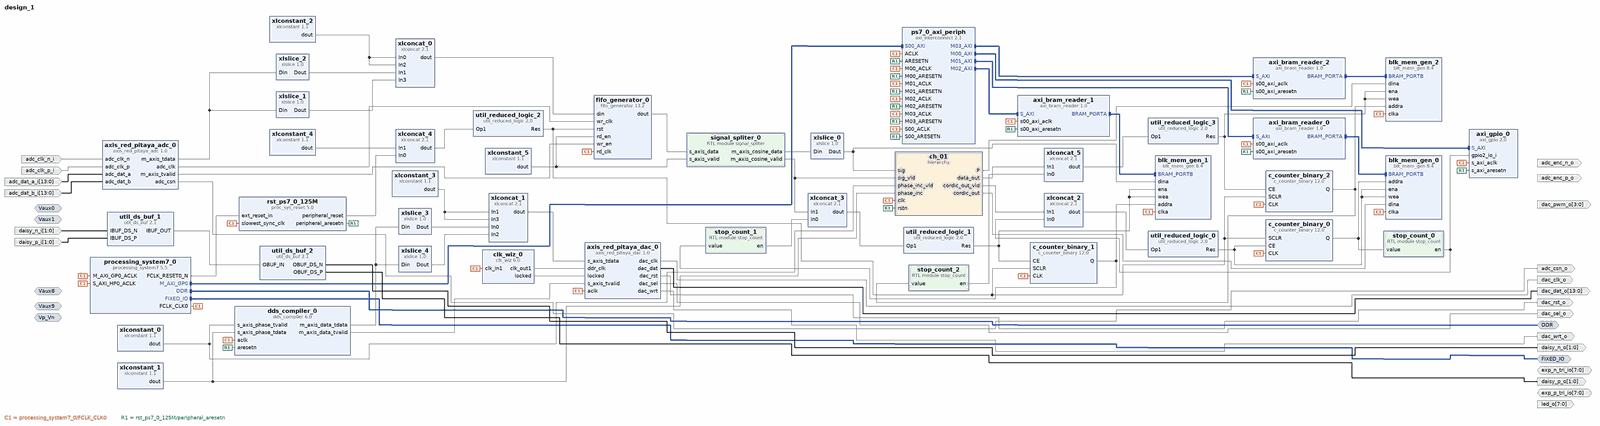
[diagram p0: block diagram of the top level, whole]
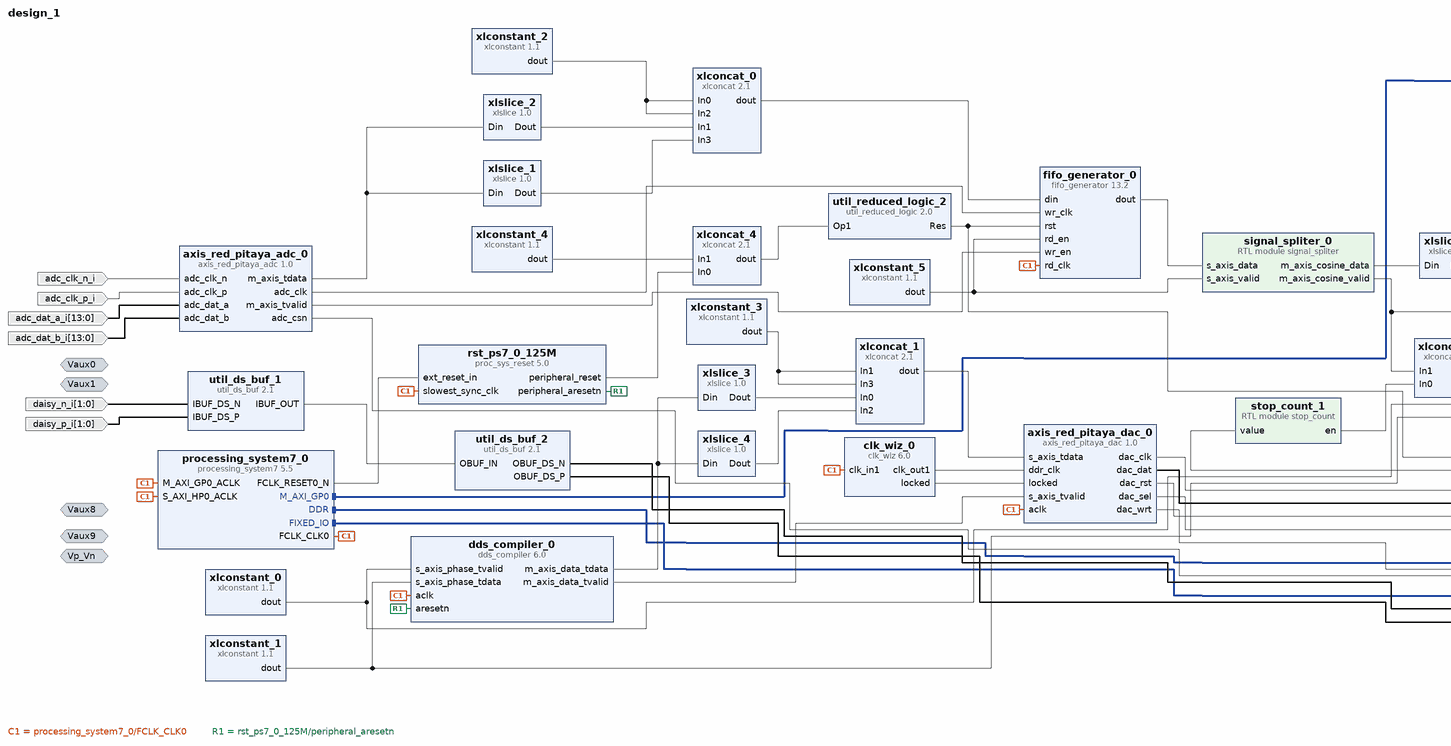
[diagram p1: block diagram of the top level, left part]
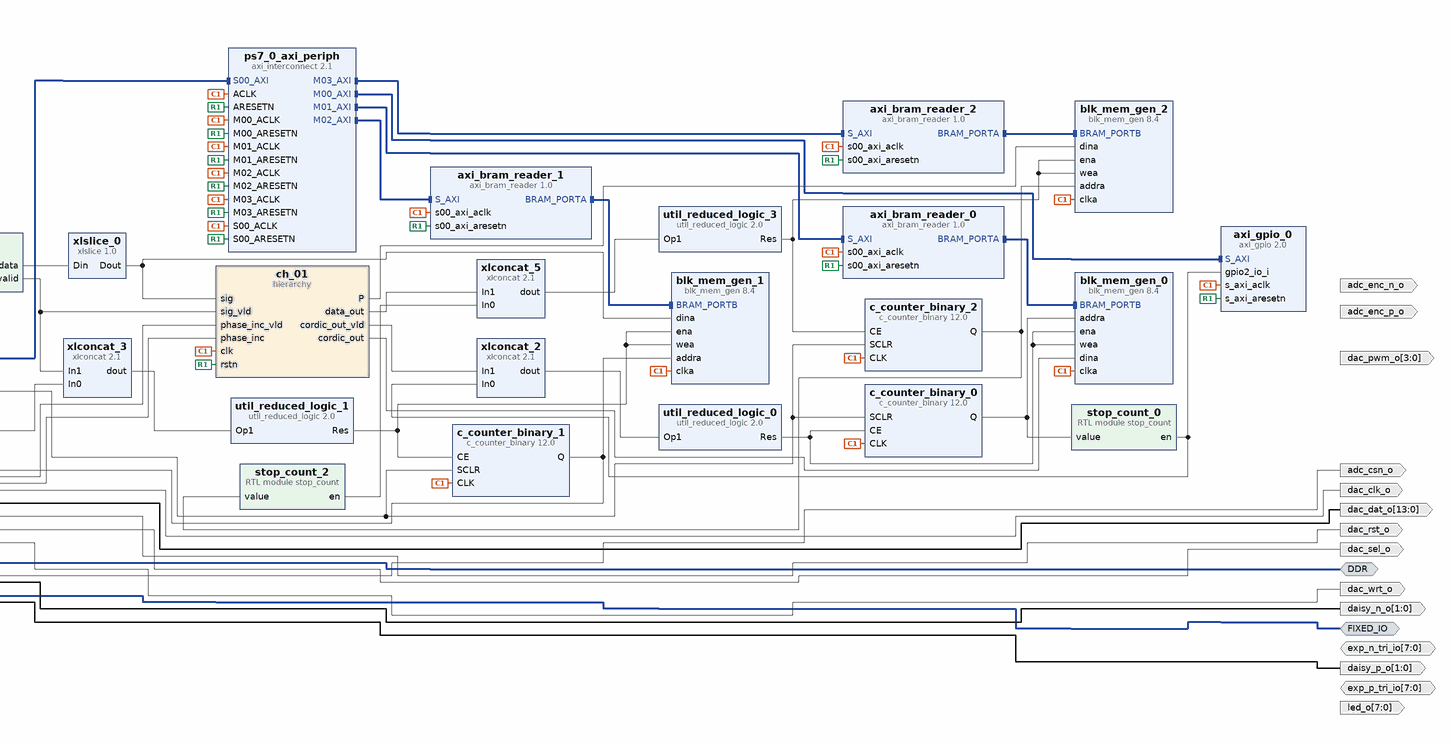
[diagram p2: block diagram of the top level, right part]
# Vivado block design design_1, xc7z010clg400-1, Vivado 2020.1
create_bd_design design_1

create_bd_intf_port -mode Master -vlnv xilinx.com:interface:ddrx_rtl:1.0 DDR
create_bd_intf_port -mode Master -vlnv xilinx.com:display_processing_system7:fixedio_rtl:1.0 FIXED_IO
create_bd_intf_port -mode Slave -vlnv xilinx.com:interface:diff_analog_io_rtl:1.0 Vaux0
create_bd_intf_port -mode Slave -vlnv xilinx.com:interface:diff_analog_io_rtl:1.0 Vaux1
create_bd_intf_port -mode Slave -vlnv xilinx.com:interface:diff_analog_io_rtl:1.0 Vaux8
create_bd_intf_port -mode Slave -vlnv xilinx.com:interface:diff_analog_io_rtl:1.0 Vaux9
create_bd_intf_port -mode Slave -vlnv xilinx.com:interface:diff_analog_io_rtl:1.0 Vp_Vn
create_bd_port -dir I adc_clk_n_i
create_bd_port -dir I adc_clk_p_i
create_bd_port -dir O adc_csn_o
create_bd_port -dir I -from 13 -to 0 adc_dat_a_i
create_bd_port -dir I -from 13 -to 0 adc_dat_b_i
create_bd_port -dir O adc_enc_n_o
create_bd_port -dir O adc_enc_p_o
create_bd_port -dir O dac_clk_o
create_bd_port -dir O -from 13 -to 0 dac_dat_o
create_bd_port -dir O -from 3 -to 0 dac_pwm_o
create_bd_port -dir O dac_rst_o
create_bd_port -dir O dac_sel_o
create_bd_port -dir O dac_wrt_o
create_bd_port -dir I -from 1 -to 0 daisy_n_i
create_bd_port -dir O -from 1 -to 0 daisy_n_o
create_bd_port -dir I -from 1 -to 0 daisy_p_i
create_bd_port -dir O -from 1 -to 0 daisy_p_o
create_bd_port -dir IO -from 7 -to 0 exp_n_tri_io
create_bd_port -dir IO -from 7 -to 0 exp_p_tri_io
create_bd_port -dir O -from 7 -to 0 led_o

create_bd_cell -type ip -vlnv xilinx.com:ip:axi_gpio:2.0 axi_gpio_0
set_property -dict [list \
  CONFIG.C_ALL_INPUTS_2 1 \
  CONFIG.C_ALL_OUTPUTS 1 \
  CONFIG.C_DOUT_DEFAULT 0x00000001 \
  CONFIG.C_GPIO2_WIDTH 1 \
  CONFIG.C_GPIO_WIDTH 1 \
  CONFIG.C_IS_DUAL 1 \
] [get_bd_cells axi_gpio_0]
create_bd_cell -type ip -vlnv pavel-demin:user:axis_red_pitaya_adc:1.0 axis_red_pitaya_adc_0
create_bd_cell -type ip -vlnv pavel-demin:user:axis_red_pitaya_dac:1.0 axis_red_pitaya_dac_0
create_bd_cell -type ip -vlnv xilinx.com:ip:dds_compiler:6.0 dds_compiler_0
set_property -dict [list \
  CONFIG.Amplitude_Mode Full_Range \
  CONFIG.DATA_Has_TLAST Not_Required \
  CONFIG.DDS_Clock_Rate 125 \
  CONFIG.Frequency_Resolution 0.4 \
  CONFIG.Has_ACLKEN false \
  CONFIG.Has_ARESETn true \
  CONFIG.Has_Phase_Out false \
  CONFIG.Latency 7 \
  CONFIG.M_DATA_Has_TUSER Not_Required \
  CONFIG.Noise_Shaping None \
  CONFIG.Output_Frequency1 0 \
  CONFIG.Output_Width 16 \
  CONFIG.PINC1 0 \
  CONFIG.Parameter_Entry Hardware_Parameters \
  CONFIG.PartsPresent Phase_Generator_and_SIN_COS_LUT \
  CONFIG.Phase_Increment Streaming \
  CONFIG.Phase_Width 16 \
  CONFIG.S_PHASE_Has_TUSER Not_Required \
  CONFIG.Spurious_Free_Dynamic_Range 45 \
] [get_bd_cells dds_compiler_0]
create_bd_cell -type ip -vlnv xilinx.com:ip:processing_system7:5.5 processing_system7_0
set_property -dict [list \
  CONFIG.PCW_APU_PERIPHERAL_FREQMHZ 666.666666 \
  CONFIG.PCW_ENET0_ENET0_IO {MIO 16 .. 27} \
  CONFIG.PCW_ENET0_GRP_MDIO_ENABLE 1 \
  CONFIG.PCW_ENET0_GRP_MDIO_IO EMIO \
  CONFIG.PCW_ENET0_PERIPHERAL_ENABLE 1 \
  CONFIG.PCW_ENET0_RESET_ENABLE 0 \
  CONFIG.PCW_ENET_RESET_ENABLE 1 \
  CONFIG.PCW_ENET_RESET_SELECT {Share reset pin} \
  CONFIG.PCW_FPGA0_PERIPHERAL_FREQMHZ 125 \
  CONFIG.PCW_FPGA1_PERIPHERAL_FREQMHZ 250 \
  CONFIG.PCW_FPGA3_PERIPHERAL_FREQMHZ 200 \
  CONFIG.PCW_GPIO_MIO_GPIO_ENABLE 1 \
  CONFIG.PCW_GPIO_MIO_GPIO_IO MIO \
  CONFIG.PCW_GPIO_PERIPHERAL_ENABLE 1 \
  CONFIG.PCW_I2C0_GRP_INT_ENABLE 0 \
  CONFIG.PCW_I2C0_I2C0_IO {MIO 50 .. 51} \
  CONFIG.PCW_I2C0_PERIPHERAL_ENABLE 1 \
  CONFIG.PCW_I2C_PERIPHERAL_FREQMHZ 111.111115 \
  CONFIG.PCW_I2C_RESET_ENABLE 1 \
  CONFIG.PCW_I2C_RESET_SELECT {Share reset pin} \
  CONFIG.PCW_IMPORT_BOARD_PRESET cfg/red_pitaya.xml \
  CONFIG.PCW_PERIPHERAL_BOARD_PRESET None \
  CONFIG.PCW_PRESET_BANK1_VOLTAGE {LVCMOS 2.5V} \
  CONFIG.PCW_QSPI_GRP_SINGLE_SS_ENABLE 1 \
  CONFIG.PCW_QSPI_GRP_SINGLE_SS_IO {MIO 1 .. 6} \
  CONFIG.PCW_QSPI_PERIPHERAL_ENABLE 1 \
  CONFIG.PCW_QSPI_PERIPHERAL_FREQMHZ 125 \
  CONFIG.PCW_QSPI_QSPI_IO {MIO 1 .. 6} \
  CONFIG.PCW_SD0_GRP_CD_ENABLE 1 \
  CONFIG.PCW_SD0_GRP_CD_IO {MIO 46} \
  CONFIG.PCW_SD0_GRP_WP_ENABLE 1 \
  CONFIG.PCW_SD0_GRP_WP_IO {MIO 47} \
  CONFIG.PCW_SD0_PERIPHERAL_ENABLE 1 \
  CONFIG.PCW_SD0_SD0_IO {MIO 40 .. 45} \
  CONFIG.PCW_SDIO_PERIPHERAL_FREQMHZ 100 \
  CONFIG.PCW_SINGLE_QSPI_DATA_MODE x4 \
  CONFIG.PCW_SPI0_PERIPHERAL_ENABLE 1 \
  CONFIG.PCW_SPI0_SPI0_IO EMIO \
  CONFIG.PCW_SPI1_PERIPHERAL_ENABLE 1 \
  CONFIG.PCW_SPI1_SPI1_IO {MIO 10 .. 15} \
  CONFIG.PCW_TTC0_PERIPHERAL_ENABLE 1 \
  CONFIG.PCW_TTC0_TTC0_IO EMIO \
  CONFIG.PCW_UART0_PERIPHERAL_ENABLE 1 \
  CONFIG.PCW_UART0_UART0_IO {MIO 14 .. 15} \
  CONFIG.PCW_UART1_PERIPHERAL_ENABLE 1 \
  CONFIG.PCW_UART1_UART1_IO {MIO 8 .. 9} \
  CONFIG.PCW_UART_PERIPHERAL_FREQMHZ 100 \
  CONFIG.PCW_UIPARAM_DDR_BUS_WIDTH {16 Bit} \
  CONFIG.PCW_UIPARAM_DDR_FREQ_MHZ 533.333333 \
  CONFIG.PCW_UIPARAM_DDR_PARTNO {MT41J256M16 RE-125} \
  CONFIG.PCW_USB0_PERIPHERAL_ENABLE 1 \
  CONFIG.PCW_USB0_RESET_ENABLE 1 \
  CONFIG.PCW_USB0_RESET_IO {MIO 48} \
  CONFIG.PCW_USB0_USB0_IO {MIO 28 .. 39} \
  CONFIG.PCW_USB_RESET_ENABLE 1 \
  CONFIG.PCW_USB_RESET_SELECT {Share reset pin} \
  CONFIG.PCW_USE_S_AXI_HP0 1 \
] [get_bd_cells processing_system7_0]
# 509 more settings of processing_system7_0 are not shown: defaults, MIO pin electricals, DDR timing, and values the tool derives
create_bd_cell -type ip -vlnv xilinx.com:ip:axi_interconnect:2.1 ps7_0_axi_periph
set_property -dict {CONFIG.NUM_MI 4} [get_bd_cells ps7_0_axi_periph]
create_bd_cell -type ip -vlnv xilinx.com:ip:proc_sys_reset:5.0 rst_ps7_0_125M
create_bd_cell -type module -reference signal_spliter signal_spliter_0
create_bd_cell -type ip -vlnv xilinx.com:ip:util_ds_buf:2.1 util_ds_buf_1
set_property -dict {CONFIG.C_SIZE 2} [get_bd_cells util_ds_buf_1]
create_bd_cell -type ip -vlnv xilinx.com:ip:util_ds_buf:2.1 util_ds_buf_2
set_property -dict {CONFIG.C_BUF_TYPE OBUFDS CONFIG.C_SIZE 2} [get_bd_cells util_ds_buf_2]
create_bd_cell -type ip -vlnv xilinx.com:ip:xlconcat:2.1 xlconcat_0
set_property -dict [list \
  CONFIG.IN0_WIDTH 2 \
  CONFIG.IN1_WIDTH 14 \
  CONFIG.IN2_WIDTH 2 \
  CONFIG.IN3_WIDTH 14 \
  CONFIG.NUM_PORTS 4 \
] [get_bd_cells xlconcat_0]
create_bd_cell -type ip -vlnv xilinx.com:ip:xlconcat:2.1 xlconcat_1
set_property -dict [list \
  CONFIG.IN0_WIDTH 14 \
  CONFIG.IN1_WIDTH 2 \
  CONFIG.IN2_WIDTH 14 \
  CONFIG.IN3_WIDTH 2 \
  CONFIG.NUM_PORTS 4 \
] [get_bd_cells xlconcat_1]
create_bd_cell -type ip -vlnv xilinx.com:ip:xlconstant:1.1 xlconstant_0
create_bd_cell -type ip -vlnv xilinx.com:ip:xlconstant:1.1 xlconstant_1
set_property -dict {CONFIG.CONST_VAL 524 CONFIG.CONST_WIDTH 16} [get_bd_cells xlconstant_1]
create_bd_cell -type ip -vlnv xilinx.com:ip:xlconstant:1.1 xlconstant_2
set_property -dict {CONFIG.CONST_VAL 0 CONFIG.CONST_WIDTH 2} [get_bd_cells xlconstant_2]
create_bd_cell -type ip -vlnv xilinx.com:ip:xlconstant:1.1 xlconstant_3
set_property -dict {CONFIG.CONST_VAL 0 CONFIG.CONST_WIDTH 2} [get_bd_cells xlconstant_3]
create_bd_cell -type ip -vlnv xilinx.com:ip:xlconstant:1.1 xlconstant_4
set_property -dict {CONFIG.CONST_VAL 0} [get_bd_cells xlconstant_4]
create_bd_cell -type ip -vlnv xilinx.com:ip:xlslice:1.0 xlslice_1
set_property -dict {CONFIG.DIN_FROM 29 CONFIG.DIN_TO 16 CONFIG.DOUT_WIDTH 14} [get_bd_cells xlslice_1]
create_bd_cell -type ip -vlnv xilinx.com:ip:xlslice:1.0 xlslice_2
set_property -dict {CONFIG.DIN_FROM 13 CONFIG.DIN_TO 0 CONFIG.DOUT_WIDTH 14} [get_bd_cells xlslice_2]
create_bd_cell -type ip -vlnv xilinx.com:ip:xlslice:1.0 xlslice_3
set_property -dict {CONFIG.DIN_FROM 15 CONFIG.DIN_TO 2 CONFIG.DOUT_WIDTH 14} [get_bd_cells xlslice_3]
create_bd_cell -type ip -vlnv xilinx.com:ip:xlslice:1.0 xlslice_4
set_property -dict {CONFIG.DIN_FROM 31 CONFIG.DIN_TO 18 CONFIG.DOUT_WIDTH 14} [get_bd_cells xlslice_4]
create_bd_cell -type ip -vlnv xilinx.com:ip:xlslice:1.0 xlslice_0
set_property -dict {CONFIG.DIN_FROM 15 CONFIG.DOUT_WIDTH 16} [get_bd_cells xlslice_0]
create_bd_cell -type ip -vlnv xilinx.com:ip:clk_wiz:6.0 clk_wiz_0
set_property -dict [list \
  CONFIG.CLKIN1_JITTER_PS 80.0 \
  CONFIG.CLKOUT1_JITTER 104.759 \
  CONFIG.CLKOUT1_PHASE_ERROR 96.948 \
  CONFIG.CLKOUT1_REQUESTED_OUT_FREQ 250 \
  CONFIG.MMCM_CLKFBOUT_MULT_F 8.000 \
  CONFIG.MMCM_CLKIN1_PERIOD 8.000 \
  CONFIG.MMCM_CLKOUT0_DIVIDE_F 4.000 \
  CONFIG.PRIM_IN_FREQ 125 \
  CONFIG.USE_RESET false \
] [get_bd_cells clk_wiz_0]
create_bd_cell -type ip -vlnv xilinx.com:ip:blk_mem_gen:8.4 blk_mem_gen_0
set_property -dict [list \
  CONFIG.Additional_Inputs_for_Power_Estimation false \
  CONFIG.Assume_Synchronous_Clk true \
  CONFIG.Enable_32bit_Address false \
  CONFIG.Enable_B Use_ENB_Pin \
  CONFIG.Memory_Type Simple_Dual_Port_RAM \
  CONFIG.Operating_Mode_A NO_CHANGE \
  CONFIG.Port_A_Clock 100 \
  CONFIG.Port_B_Clock 100 \
  CONFIG.Port_B_Enable_Rate 100 \
  CONFIG.Read_Width_B 32 \
  CONFIG.Register_PortB_Output_of_Memory_Primitives true \
  CONFIG.Use_Byte_Write_Enable false \
  CONFIG.Write_Depth_A 1024 \
  CONFIG.Write_Width_A 32 \
  CONFIG.Write_Width_B 32 \
  CONFIG.use_bram_block Stand_Alone \
] [get_bd_cells blk_mem_gen_0]
create_bd_cell -type ip -vlnv xilinx.com:ip:c_counter_binary:12.0 c_counter_binary_0
set_property -dict [list \
  CONFIG.CE true \
  CONFIG.Final_Count_Value 400 \
  CONFIG.Load false \
  CONFIG.Output_Width 11 \
  CONFIG.Restrict_Count true \
  CONFIG.SCLR true \
] [get_bd_cells c_counter_binary_0]
create_bd_cell -type ip -vlnv anton-potocnik:user:axi_bram_reader:1.0 axi_bram_reader_0
create_bd_cell -type ip -vlnv xilinx.com:ip:blk_mem_gen:8.4 blk_mem_gen_1
set_property -dict [list \
  CONFIG.Enable_32bit_Address false \
  CONFIG.Enable_B Use_ENB_Pin \
  CONFIG.Memory_Type Simple_Dual_Port_RAM \
  CONFIG.Operating_Mode_A NO_CHANGE \
  CONFIG.Port_B_Clock 100 \
  CONFIG.Port_B_Enable_Rate 100 \
  CONFIG.Read_Width_B 32 \
  CONFIG.Register_PortB_Output_of_Memory_Primitives true \
  CONFIG.Use_Byte_Write_Enable false \
  CONFIG.Write_Depth_A 1024 \
  CONFIG.Write_Width_A 32 \
  CONFIG.Write_Width_B 32 \
  CONFIG.use_bram_block Stand_Alone \
] [get_bd_cells blk_mem_gen_1]
create_bd_cell -type ip -vlnv anton-potocnik:user:axi_bram_reader:1.0 axi_bram_reader_1
create_bd_cell -type ip -vlnv xilinx.com:ip:c_counter_binary:12.0 c_counter_binary_1
set_property -dict [list \
  CONFIG.CE true \
  CONFIG.Final_Count_Value 400 \
  CONFIG.Load false \
  CONFIG.Output_Width 11 \
  CONFIG.Restrict_Count true \
  CONFIG.SCLR true \
] [get_bd_cells c_counter_binary_1]
create_bd_cell -type module -reference stop_count stop_count_0
create_bd_cell -type module -reference stop_count stop_count_1
create_bd_cell -type ip -vlnv xilinx.com:ip:util_reduced_logic:2.0 util_reduced_logic_0
set_property -dict {CONFIG.C_SIZE 2} [get_bd_cells util_reduced_logic_0]
create_bd_cell -type ip -vlnv xilinx.com:ip:xlconcat:2.1 xlconcat_2
create_bd_cell -type ip -vlnv xilinx.com:ip:util_reduced_logic:2.0 util_reduced_logic_1
set_property -dict {CONFIG.C_SIZE 2} [get_bd_cells util_reduced_logic_1]
create_bd_cell -type ip -vlnv xilinx.com:ip:xlconcat:2.1 xlconcat_3
create_bd_cell -type hier ch_01
create_bd_cell -type ip -vlnv xilinx.com:ip:fifo_generator:13.2 fifo_generator_0
set_property -dict [list \
  CONFIG.Enable_Reset_Synchronization true \
  CONFIG.Enable_Safety_Circuit true \
  CONFIG.FIFO_Implementation_rach Common_Clock_Distributed_RAM \
  CONFIG.FIFO_Implementation_wach Common_Clock_Distributed_RAM \
  CONFIG.FIFO_Implementation_wrch Common_Clock_Distributed_RAM \
  CONFIG.Fifo_Implementation Independent_Clocks_Block_RAM \
  CONFIG.Full_Flags_Reset_Value 1 \
  CONFIG.INTERFACE_TYPE Native \
  CONFIG.Input_Data_Width 32 \
  CONFIG.Input_Depth 16 \
  CONFIG.Output_Data_Width 32 \
  CONFIG.Read_Data_Count true \
  CONFIG.Read_Data_Count_Width 4 \
  CONFIG.Reset_Pin true \
  CONFIG.Use_Dout_Reset true \
  CONFIG.Use_Embedded_Registers false \
  CONFIG.Write_Acknowledge_Flag false \
  CONFIG.Write_Data_Count true \
  CONFIG.Write_Data_Count_Width 4 \
] [get_bd_cells fifo_generator_0]
create_bd_cell -type ip -vlnv xilinx.com:ip:xlconstant:1.1 xlconstant_5
create_bd_cell -type ip -vlnv xilinx.com:ip:util_reduced_logic:2.0 util_reduced_logic_2
set_property -dict {CONFIG.C_OPERATION or CONFIG.C_SIZE 2} [get_bd_cells util_reduced_logic_2]
create_bd_cell -type ip -vlnv xilinx.com:ip:xlconcat:2.1 xlconcat_4
create_bd_cell -type ip -vlnv xilinx.com:ip:blk_mem_gen:8.4 blk_mem_gen_2
set_property -dict [list \
  CONFIG.Enable_32bit_Address false \
  CONFIG.Enable_B Use_ENB_Pin \
  CONFIG.Memory_Type Simple_Dual_Port_RAM \
  CONFIG.Operating_Mode_A NO_CHANGE \
  CONFIG.Port_B_Clock 100 \
  CONFIG.Port_B_Enable_Rate 100 \
  CONFIG.Read_Width_B 32 \
  CONFIG.Register_PortB_Output_of_Memory_Primitives true \
  CONFIG.Use_Byte_Write_Enable false \
  CONFIG.Write_Depth_A 1024 \
  CONFIG.Write_Width_A 32 \
  CONFIG.Write_Width_B 32 \
  CONFIG.use_bram_block Stand_Alone \
] [get_bd_cells blk_mem_gen_2]
create_bd_cell -type ip -vlnv anton-potocnik:user:axi_bram_reader:1.0 axi_bram_reader_2
create_bd_cell -type ip -vlnv xilinx.com:ip:c_counter_binary:12.0 c_counter_binary_2
set_property -dict [list \
  CONFIG.CE true \
  CONFIG.Final_Count_Value 400 \
  CONFIG.Load false \
  CONFIG.Output_Width 11 \
  CONFIG.Restrict_Count true \
  CONFIG.SCLR true \
] [get_bd_cells c_counter_binary_2]
create_bd_cell -type ip -vlnv xilinx.com:ip:util_reduced_logic:2.0 util_reduced_logic_3
set_property -dict {CONFIG.C_SIZE 2} [get_bd_cells util_reduced_logic_3]
create_bd_cell -type ip -vlnv xilinx.com:ip:xlconcat:2.1 xlconcat_5
create_bd_cell -type module -reference stop_count stop_count_2

# ---- hierarchy /ch_01 ----
current_bd_instance /ch_01
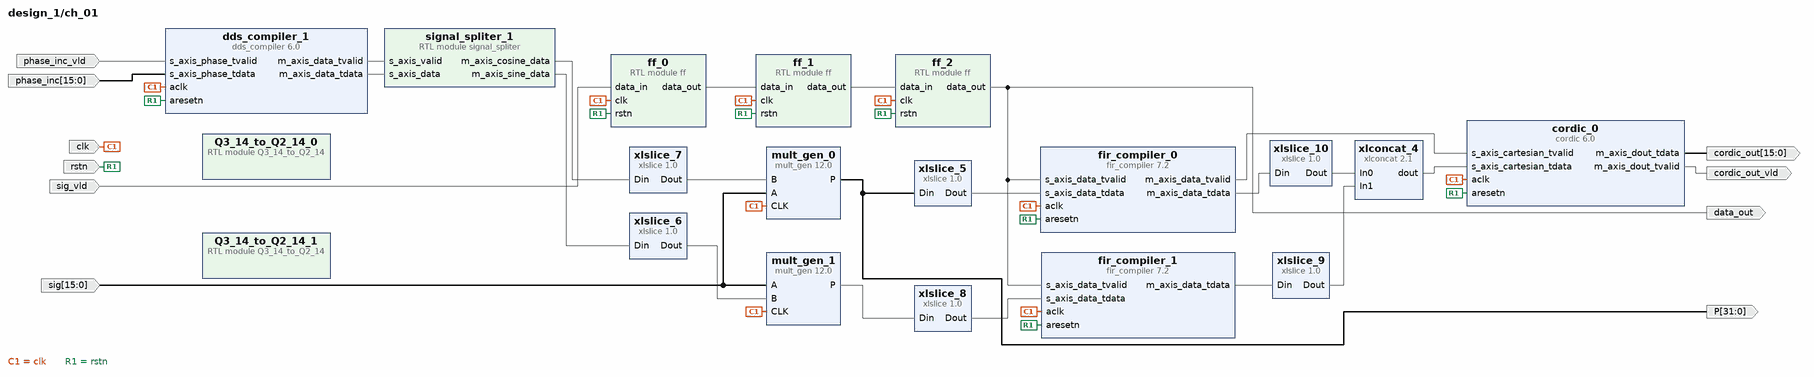
[diagram p3: block diagram inside /ch_01]
create_bd_pin -dir I -type clk clk
create_bd_pin -dir I -type rst rstn
create_bd_pin -dir O cordic_out_vld
create_bd_pin -dir O -from 15 -to 0 cordic_out
create_bd_pin -dir I phase_inc_vld
create_bd_pin -dir I -from 15 -to 0 phase_inc
create_bd_pin -dir I sig_vld
create_bd_pin -dir I -from 15 -to 0 sig
create_bd_pin -dir O -from 31 -to 0 -type data P
create_bd_pin -dir O data_out

create_bd_cell -type module -reference Q3_14_to_Q2_14 Q3_14_to_Q2_14_0
create_bd_cell -type module -reference Q3_14_to_Q2_14 Q3_14_to_Q2_14_1
create_bd_cell -type ip -vlnv xilinx.com:ip:cordic:6.0 cordic_0
set_property -dict [list \
  CONFIG.ARESETN true \
  CONFIG.Data_Format SignedFraction \
  CONFIG.Functional_Selection Arc_Tan \
  CONFIG.Input_Width 16 \
] [get_bd_cells cordic_0]
create_bd_cell -type ip -vlnv xilinx.com:ip:dds_compiler:6.0 dds_compiler_1
set_property -dict [list \
  CONFIG.Amplitude_Mode Full_Range \
  CONFIG.DATA_Has_TLAST Not_Required \
  CONFIG.DDS_Clock_Rate 125 \
  CONFIG.Frequency_Resolution 0.4 \
  CONFIG.Has_ACLKEN false \
  CONFIG.Has_ARESETn true \
  CONFIG.Has_Phase_Out false \
  CONFIG.Latency 7 \
  CONFIG.M_DATA_Has_TUSER Not_Required \
  CONFIG.Noise_Shaping None \
  CONFIG.Output_Frequency1 0 \
  CONFIG.Output_Width 16 \
  CONFIG.PINC1 0 \
  CONFIG.Parameter_Entry Hardware_Parameters \
  CONFIG.PartsPresent Phase_Generator_and_SIN_COS_LUT \
  CONFIG.Phase_Increment Streaming \
  CONFIG.Phase_Width 16 \
  CONFIG.S_PHASE_Has_TUSER Not_Required \
  CONFIG.Spurious_Free_Dynamic_Range 45 \
] [get_bd_cells dds_compiler_1]
create_bd_cell -type module -reference ff ff_0
create_bd_cell -type module -reference ff ff_1
create_bd_cell -type module -reference ff ff_2
create_bd_cell -type ip -vlnv xilinx.com:ip:fir_compiler:7.2 fir_compiler_0
set_property -dict [list \
  CONFIG.Channel_Sequence Basic \
  CONFIG.Clock_Frequency 125 \
  CONFIG.CoefficientVector {0.128241, 0.009100, 0.009381, 0.009710, 0.009974, 0.010281, 0.010538, 0.010826, 0.011053, 0.011332, 0.011563, 0.011688, 0.012018, 0.012223, 0.012348, 0.012513, 0.012636, 0.012782, 0.012896, 0.013029, 0.013097, 0.013190, 0.013254, 0.013289, 0.013299, 0.013335, 0.013299, 0.013289, 0.013254, 0.013190, 0.013097, 0.013029, 0.012896, 0.012782, 0.012636, 0.012513, 0.012348, 0.012223, 0.012018, 0.011688, 0.011563, 0.011332, 0.011053, 0.010826, 0.010538, 0.010281, 0.009974, 0.009710, 0.009381, 0.009100, 0.128241} \
  CONFIG.Coefficient_Fractional_Bits 18 \
  CONFIG.Coefficient_Sets 1 \
  CONFIG.Coefficient_Sign Unsigned \
  CONFIG.Coefficient_Structure Inferred \
  CONFIG.Coefficient_Width 16 \
  CONFIG.ColumnConfig 13 \
  CONFIG.DATA_Has_TLAST Not_Required \
  CONFIG.Data_Fractional_Bits 14 \
  CONFIG.Data_Sign Signed \
  CONFIG.Data_Width 16 \
  CONFIG.Decimation_Rate 2 \
  CONFIG.Filter_Architecture Systolic_Multiply_Accumulate \
  CONFIG.Filter_Type Decimation \
  CONFIG.Has_ARESETn true \
  CONFIG.Interpolation_Rate 1 \
  CONFIG.M_DATA_Has_TUSER Not_Required \
  CONFIG.Number_Channels 1 \
  CONFIG.Output_Rounding_Mode Full_Precision \
  CONFIG.Output_Width 34 \
  CONFIG.Quantization Quantize_Only \
  CONFIG.RateSpecification Frequency_Specification \
  CONFIG.S_DATA_Has_TUSER Not_Required \
  CONFIG.Sample_Frequency 125 \
  CONFIG.Select_Pattern All \
  CONFIG.Zero_Pack_Factor 1 \
] [get_bd_cells fir_compiler_0]
create_bd_cell -type ip -vlnv xilinx.com:ip:fir_compiler:7.2 fir_compiler_1
set_property -dict [list \
  CONFIG.Channel_Sequence Basic \
  CONFIG.Clock_Frequency 125 \
  CONFIG.CoefficientVector {0.128241, 0.009100, 0.009381, 0.009710, 0.009974, 0.010281, 0.010538, 0.010826, 0.011053, 0.011332, 0.011563, 0.011688, 0.012018, 0.012223, 0.012348, 0.012513, 0.012636, 0.012782, 0.012896, 0.013029, 0.013097, 0.013190, 0.013254, 0.013289, 0.013299, 0.013335, 0.013299, 0.013289, 0.013254, 0.013190, 0.013097, 0.013029, 0.012896, 0.012782, 0.012636, 0.012513, 0.012348, 0.012223, 0.012018, 0.011688, 0.011563, 0.011332, 0.011053, 0.010826, 0.010538, 0.010281, 0.009974, 0.009710, 0.009381, 0.009100, 0.128241} \
  CONFIG.Coefficient_Fractional_Bits 18 \
  CONFIG.Coefficient_Sets 1 \
  CONFIG.Coefficient_Sign Unsigned \
  CONFIG.Coefficient_Structure Inferred \
  CONFIG.Coefficient_Width 16 \
  CONFIG.ColumnConfig 13 \
  CONFIG.DATA_Has_TLAST Not_Required \
  CONFIG.Data_Fractional_Bits 14 \
  CONFIG.Data_Sign Signed \
  CONFIG.Data_Width 16 \
  CONFIG.Decimation_Rate 2 \
  CONFIG.Filter_Architecture Systolic_Multiply_Accumulate \
  CONFIG.Filter_Type Decimation \
  CONFIG.Has_ARESETn true \
  CONFIG.Interpolation_Rate 1 \
  CONFIG.M_DATA_Has_TUSER Not_Required \
  CONFIG.Number_Channels 1 \
  CONFIG.Output_Rounding_Mode Full_Precision \
  CONFIG.Output_Width 34 \
  CONFIG.Quantization Quantize_Only \
  CONFIG.RateSpecification Frequency_Specification \
  CONFIG.S_DATA_Has_TUSER Not_Required \
  CONFIG.Sample_Frequency 125 \
  CONFIG.Select_Pattern All \
  CONFIG.Zero_Pack_Factor 1 \
] [get_bd_cells fir_compiler_1]
create_bd_cell -type ip -vlnv xilinx.com:ip:mult_gen:12.0 mult_gen_0
set_property -dict [list \
  CONFIG.Multiplier_Construction Use_Mults \
  CONFIG.OutputWidthHigh 31 \
  CONFIG.PipeStages 3 \
  CONFIG.PortAType Signed \
  CONFIG.PortAWidth 16 \
  CONFIG.PortBType Signed \
  CONFIG.PortBWidth 16 \
  CONFIG.Use_Custom_Output_Width true \
] [get_bd_cells mult_gen_0]
create_bd_cell -type ip -vlnv xilinx.com:ip:mult_gen:12.0 mult_gen_1
set_property -dict [list \
  CONFIG.Multiplier_Construction Use_Mults \
  CONFIG.OutputWidthHigh 31 \
  CONFIG.PipeStages 3 \
  CONFIG.PortAType Signed \
  CONFIG.PortAWidth 16 \
  CONFIG.PortBType Signed \
  CONFIG.PortBWidth 16 \
  CONFIG.Use_Custom_Output_Width true \
] [get_bd_cells mult_gen_1]
create_bd_cell -type module -reference signal_spliter signal_spliter_1
create_bd_cell -type ip -vlnv xilinx.com:ip:xlconcat:2.1 xlconcat_4
set_property -dict {CONFIG.IN0_WIDTH 16 CONFIG.IN1_WIDTH 16} [get_bd_cells xlconcat_4]
create_bd_cell -type ip -vlnv xilinx.com:ip:xlslice:1.0 xlslice_5
set_property -dict {CONFIG.DIN_FROM 31 CONFIG.DIN_TO 16 CONFIG.DIN_WIDTH 32 CONFIG.DOUT_WIDTH 16} [get_bd_cells xlslice_5]
create_bd_cell -type ip -vlnv xilinx.com:ip:xlslice:1.0 xlslice_6
set_property -dict {CONFIG.DIN_FROM 15 CONFIG.DOUT_WIDTH 16} [get_bd_cells xlslice_6]
create_bd_cell -type ip -vlnv xilinx.com:ip:xlslice:1.0 xlslice_7
set_property -dict {CONFIG.DIN_FROM 15 CONFIG.DOUT_WIDTH 16} [get_bd_cells xlslice_7]
create_bd_cell -type ip -vlnv xilinx.com:ip:xlslice:1.0 xlslice_8
set_property -dict {CONFIG.DIN_FROM 31 CONFIG.DIN_TO 16 CONFIG.DIN_WIDTH 32 CONFIG.DOUT_WIDTH 16} [get_bd_cells xlslice_8]
create_bd_cell -type ip -vlnv xilinx.com:ip:xlslice:1.0 xlslice_9
set_property -dict {CONFIG.DIN_FROM 33 CONFIG.DIN_TO 18 CONFIG.DIN_WIDTH 40 CONFIG.DOUT_WIDTH 16} [get_bd_cells xlslice_9]
create_bd_cell -type ip -vlnv xilinx.com:ip:xlslice:1.0 xlslice_10
set_property -dict {CONFIG.DIN_FROM 33 CONFIG.DIN_TO 18 CONFIG.DIN_WIDTH 40 CONFIG.DOUT_WIDTH 16} [get_bd_cells xlslice_10]

# ---- connections ----

current_bd_instance /ch_01
connect_bd_net [get_bd_pins fir_compiler_0/m_axis_data_tvalid] [get_bd_pins cordic_0/s_axis_cartesian_tvalid]
connect_bd_net -net xlconcat_2_dout1 [get_bd_pins xlconcat_4/dout] [get_bd_pins cordic_0/s_axis_cartesian_tdata]
connect_bd_net -net dds_compiler_0_m_axis_data_tvalid1 [get_bd_pins dds_compiler_1/m_axis_data_tvalid] [get_bd_pins signal_spliter_1/s_axis_valid]
connect_bd_net -net dds_compiler_0_m_axis_data_tdata1 [get_bd_pins dds_compiler_1/m_axis_data_tdata] [get_bd_pins signal_spliter_1/s_axis_data]
connect_bd_net [get_bd_pins ff_0/data_out] [get_bd_pins ff_1/data_in]
connect_bd_net [get_bd_pins ff_1/data_out] [get_bd_pins ff_2/data_in]
connect_bd_net [get_bd_pins ff_2/data_out] \
  [get_bd_pins fir_compiler_0/s_axis_data_tvalid] [get_bd_pins fir_compiler_1/s_axis_data_tvalid] [get_bd_pins data_out]
connect_bd_net -net xlslice_0_Dout1 [get_bd_pins xlslice_5/Dout] [get_bd_pins fir_compiler_0/s_axis_data_tdata]
connect_bd_net [get_bd_pins fir_compiler_0/m_axis_data_tdata] [get_bd_pins xlslice_10/Din]
connect_bd_net -net xlslice_5_Dout [get_bd_pins xlslice_8/Dout] [get_bd_pins fir_compiler_1/s_axis_data_tdata]
connect_bd_net [get_bd_pins fir_compiler_1/m_axis_data_tdata] [get_bd_pins xlslice_9/Din]
connect_bd_net -net xlslice_2_Dout1 [get_bd_pins xlslice_7/Dout] [get_bd_pins mult_gen_0/B]
connect_bd_net [get_bd_pins mult_gen_0/P] [get_bd_pins xlslice_5/Din] [get_bd_pins P]
connect_bd_net -net xlslice_1_Dout1 [get_bd_pins xlslice_6/Dout] [get_bd_pins mult_gen_1/B]
connect_bd_net [get_bd_pins mult_gen_1/P] [get_bd_pins xlslice_8/Din]
connect_bd_net -net signal_spliter_0_m_axis_sine_data [get_bd_pins signal_spliter_1/m_axis_sine_data] [get_bd_pins xlslice_6/Din]
connect_bd_net -net signal_spliter_0_m_axis_cosine_data1 [get_bd_pins signal_spliter_1/m_axis_cosine_data] [get_bd_pins xlslice_7/Din]
connect_bd_net -net processing_system7_0_FCLK_CLK1 [get_bd_pins clk] \
  [get_bd_pins dds_compiler_1/aclk] [get_bd_pins fir_compiler_0/aclk] [get_bd_pins mult_gen_0/CLK] [get_bd_pins ff_0/clk] \
  [get_bd_pins ff_1/clk] [get_bd_pins ff_2/clk] [get_bd_pins mult_gen_1/CLK] [get_bd_pins fir_compiler_1/aclk] \
  [get_bd_pins cordic_0/aclk]
connect_bd_net -net rst_ps7_0_125M_peripheral_aresetn1 [get_bd_pins rstn] \
  [get_bd_pins dds_compiler_1/aresetn] [get_bd_pins fir_compiler_0/aresetn] [get_bd_pins ff_0/rstn] [get_bd_pins ff_1/rstn] \
  [get_bd_pins ff_2/rstn] [get_bd_pins fir_compiler_1/aresetn] [get_bd_pins cordic_0/aresetn]
connect_bd_net [get_bd_pins cordic_0/m_axis_dout_tvalid] [get_bd_pins cordic_out_vld]
connect_bd_net [get_bd_pins cordic_0/m_axis_dout_tdata] [get_bd_pins cordic_out]
connect_bd_net [get_bd_pins phase_inc_vld] [get_bd_pins dds_compiler_1/s_axis_phase_tvalid]
connect_bd_net [get_bd_pins phase_inc] [get_bd_pins dds_compiler_1/s_axis_phase_tdata]
connect_bd_net [get_bd_pins sig_vld] [get_bd_pins ff_0/data_in]
connect_bd_net [get_bd_pins sig] [get_bd_pins mult_gen_1/A] [get_bd_pins mult_gen_0/A]
connect_bd_net [get_bd_pins xlslice_10/Dout] [get_bd_pins xlconcat_4/In0]
connect_bd_net [get_bd_pins xlslice_9/Dout] [get_bd_pins xlconcat_4/In1]

current_bd_instance /
connect_bd_intf_net [get_bd_intf_pins ps7_0_axi_periph/M02_AXI] [get_bd_intf_pins axi_bram_reader_1/S_AXI]
connect_bd_intf_net [get_bd_intf_pins axi_bram_reader_0/BRAM_PORTA] [get_bd_intf_pins blk_mem_gen_0/BRAM_PORTB]
connect_bd_intf_net [get_bd_intf_pins axi_bram_reader_1/BRAM_PORTA] [get_bd_intf_pins blk_mem_gen_1/BRAM_PORTB]
connect_bd_intf_net [get_bd_intf_pins processing_system7_0/M_AXI_GP0] [get_bd_intf_pins ps7_0_axi_periph/S00_AXI]
connect_bd_intf_net [get_bd_intf_pins ps7_0_axi_periph/M00_AXI] [get_bd_intf_pins axi_gpio_0/S_AXI]
connect_bd_intf_net [get_bd_intf_pins ps7_0_axi_periph/M01_AXI] [get_bd_intf_pins axi_bram_reader_0/S_AXI]
connect_bd_intf_net [get_bd_intf_pins axi_bram_reader_2/BRAM_PORTA] [get_bd_intf_pins blk_mem_gen_2/BRAM_PORTB]
connect_bd_intf_net [get_bd_intf_ports DDR] [get_bd_intf_pins processing_system7_0/DDR]
connect_bd_intf_net [get_bd_intf_ports FIXED_IO] [get_bd_intf_pins processing_system7_0/FIXED_IO]
connect_bd_intf_net [get_bd_intf_pins ps7_0_axi_periph/M03_AXI] [get_bd_intf_pins axi_bram_reader_2/S_AXI]
connect_bd_net [get_bd_ports adc_clk_n_i] [get_bd_pins axis_red_pitaya_adc_0/adc_clk_n]
connect_bd_net [get_bd_ports adc_clk_p_i] [get_bd_pins axis_red_pitaya_adc_0/adc_clk_p]
connect_bd_net [get_bd_ports adc_dat_a_i] [get_bd_pins axis_red_pitaya_adc_0/adc_dat_a]
connect_bd_net [get_bd_ports adc_dat_b_i] [get_bd_pins axis_red_pitaya_adc_0/adc_dat_b]
connect_bd_net [get_bd_pins axis_red_pitaya_adc_0/adc_clk] [get_bd_pins fifo_generator_0/wr_clk]
connect_bd_net [get_bd_pins axis_red_pitaya_adc_0/adc_csn] [get_bd_ports adc_csn_o]
connect_bd_net [get_bd_pins axis_red_pitaya_adc_0/m_axis_tdata] [get_bd_pins xlslice_2/Din] [get_bd_pins xlslice_1/Din]
connect_bd_net [get_bd_pins axis_red_pitaya_adc_0/m_axis_tvalid] [get_bd_pins fifo_generator_0/wr_en]
connect_bd_net [get_bd_pins axis_red_pitaya_dac_0/dac_clk] [get_bd_ports dac_clk_o]
connect_bd_net [get_bd_pins axis_red_pitaya_dac_0/dac_dat] [get_bd_ports dac_dat_o]
connect_bd_net [get_bd_pins axis_red_pitaya_dac_0/dac_rst] [get_bd_ports dac_rst_o]
connect_bd_net [get_bd_pins axis_red_pitaya_dac_0/dac_sel] [get_bd_ports dac_sel_o]
connect_bd_net [get_bd_pins axis_red_pitaya_dac_0/dac_wrt] [get_bd_ports dac_wrt_o]
connect_bd_net [get_bd_ports daisy_n_i] [get_bd_pins util_ds_buf_1/IBUF_DS_N]
connect_bd_net [get_bd_ports daisy_p_i] [get_bd_pins util_ds_buf_1/IBUF_DS_P]
connect_bd_net [get_bd_pins dds_compiler_0/m_axis_data_tdata] [get_bd_pins xlslice_3/Din] [get_bd_pins xlslice_4/Din]
connect_bd_net [get_bd_pins dds_compiler_0/m_axis_data_tvalid] [get_bd_pins axis_red_pitaya_dac_0/s_axis_tvalid]
connect_bd_net [get_bd_pins processing_system7_0/FCLK_CLK0] \
  [get_bd_pins processing_system7_0/M_AXI_GP0_ACLK] [get_bd_pins processing_system7_0/S_AXI_HP0_ACLK] \
  [get_bd_pins ps7_0_axi_periph/S00_ACLK] [get_bd_pins rst_ps7_0_125M/slowest_sync_clk] [get_bd_pins axi_gpio_0/s_axi_aclk] \
  [get_bd_pins ps7_0_axi_periph/M00_ACLK] [get_bd_pins ps7_0_axi_periph/ACLK] [get_bd_pins axis_red_pitaya_dac_0/aclk] \
  [get_bd_pins dds_compiler_0/aclk] [get_bd_pins clk_wiz_0/clk_in1] [get_bd_pins blk_mem_gen_0/clka] \
  [get_bd_pins c_counter_binary_0/CLK] [get_bd_pins axi_bram_reader_0/s00_axi_aclk] [get_bd_pins ps7_0_axi_periph/M01_ACLK] \
  [get_bd_pins axi_bram_reader_1/s00_axi_aclk] [get_bd_pins ps7_0_axi_periph/M02_ACLK] [get_bd_pins blk_mem_gen_1/clka] \
  [get_bd_pins c_counter_binary_1/CLK] [get_bd_pins ch_01/clk] [get_bd_pins fifo_generator_0/rd_clk] \
  [get_bd_pins axi_bram_reader_2/s00_axi_aclk] [get_bd_pins ps7_0_axi_periph/M03_ACLK] [get_bd_pins blk_mem_gen_2/clka] \
  [get_bd_pins c_counter_binary_2/CLK]
connect_bd_net [get_bd_pins processing_system7_0/FCLK_RESET0_N] [get_bd_pins rst_ps7_0_125M/ext_reset_in]
connect_bd_net [get_bd_pins rst_ps7_0_125M/peripheral_aresetn] \
  [get_bd_pins ps7_0_axi_periph/S00_ARESETN] [get_bd_pins axi_gpio_0/s_axi_aresetn] \
  [get_bd_pins ps7_0_axi_periph/M00_ARESETN] [get_bd_pins ps7_0_axi_periph/ARESETN] [get_bd_pins dds_compiler_0/aresetn] \
  [get_bd_pins axi_bram_reader_0/s00_axi_aresetn] [get_bd_pins ps7_0_axi_periph/M01_ARESETN] \
  [get_bd_pins axi_bram_reader_1/s00_axi_aresetn] [get_bd_pins ps7_0_axi_periph/M02_ARESETN] [get_bd_pins ch_01/rstn] \
  [get_bd_pins axi_bram_reader_2/s00_axi_aresetn] [get_bd_pins ps7_0_axi_periph/M03_ARESETN]
connect_bd_net [get_bd_pins util_ds_buf_1/IBUF_OUT] [get_bd_pins util_ds_buf_2/OBUF_IN]
connect_bd_net [get_bd_pins util_ds_buf_2/OBUF_DS_N] [get_bd_ports daisy_n_o]
connect_bd_net [get_bd_pins util_ds_buf_2/OBUF_DS_P] [get_bd_ports daisy_p_o]
connect_bd_net [get_bd_pins xlconcat_0/dout] [get_bd_pins fifo_generator_0/din]
connect_bd_net [get_bd_pins xlconcat_1/dout] [get_bd_pins axis_red_pitaya_dac_0/s_axis_tdata]
connect_bd_net [get_bd_pins xlconstant_0/dout] [get_bd_pins dds_compiler_0/s_axis_phase_tvalid] [get_bd_pins ch_01/phase_inc_vld]
connect_bd_net [get_bd_pins xlconstant_1/dout] [get_bd_pins dds_compiler_0/s_axis_phase_tdata] [get_bd_pins ch_01/phase_inc]
connect_bd_net [get_bd_pins xlconstant_2/dout] [get_bd_pins xlconcat_0/In0] [get_bd_pins xlconcat_0/In2]
connect_bd_net [get_bd_pins xlconstant_3/dout] [get_bd_pins xlconcat_1/In1] [get_bd_pins xlconcat_1/In3]
connect_bd_net [get_bd_pins xlslice_1/Dout] [get_bd_pins xlconcat_0/In3]
connect_bd_net [get_bd_pins xlslice_2/Dout] [get_bd_pins xlconcat_0/In1]
connect_bd_net [get_bd_pins xlslice_3/Dout] [get_bd_pins xlconcat_1/In0]
connect_bd_net [get_bd_pins xlslice_4/Dout] [get_bd_pins xlconcat_1/In2]
connect_bd_net [get_bd_pins signal_spliter_0/m_axis_cosine_data] [get_bd_pins xlslice_0/Din]
connect_bd_net [get_bd_pins xlslice_0/Dout] [get_bd_pins blk_mem_gen_1/dina] [get_bd_pins ch_01/sig]
connect_bd_net [get_bd_pins signal_spliter_0/m_axis_cosine_valid] [get_bd_pins xlconcat_3/In1] [get_bd_pins ch_01/sig_vld]
connect_bd_net [get_bd_pins clk_wiz_0/clk_out1] [get_bd_pins axis_red_pitaya_dac_0/ddr_clk]
connect_bd_net [get_bd_pins clk_wiz_0/locked] [get_bd_pins axis_red_pitaya_dac_0/locked]
connect_bd_net [get_bd_pins c_counter_binary_0/Q] [get_bd_pins blk_mem_gen_0/addra] [get_bd_pins stop_count_0/value]
connect_bd_net [get_bd_pins c_counter_binary_1/Q] [get_bd_pins blk_mem_gen_1/addra] [get_bd_pins stop_count_1/value]
connect_bd_net [get_bd_pins stop_count_1/en] [get_bd_pins xlconcat_3/In0]
connect_bd_net [get_bd_pins stop_count_0/en] [get_bd_pins xlconcat_2/In0] [get_bd_pins axi_gpio_0/gpio2_io_i]
connect_bd_net [get_bd_pins xlconcat_2/dout] [get_bd_pins util_reduced_logic_0/Op1]
connect_bd_net [get_bd_pins util_reduced_logic_0/Res] \
  [get_bd_pins blk_mem_gen_0/ena] [get_bd_pins blk_mem_gen_0/wea] [get_bd_pins c_counter_binary_0/CE]
connect_bd_net [get_bd_pins util_reduced_logic_1/Res] \
  [get_bd_pins blk_mem_gen_1/ena] [get_bd_pins blk_mem_gen_1/wea] [get_bd_pins c_counter_binary_1/CE]
connect_bd_net [get_bd_pins xlconcat_3/dout] [get_bd_pins util_reduced_logic_1/Op1]
connect_bd_net [get_bd_pins ch_01/cordic_out_vld] [get_bd_pins xlconcat_2/In1]
connect_bd_net [get_bd_pins ch_01/cordic_out] [get_bd_pins blk_mem_gen_0/dina]
connect_bd_net -net rst_ps7_0_125M_peripheral_reset [get_bd_pins util_reduced_logic_2/Res] \
  [get_bd_pins fifo_generator_0/rst] [get_bd_pins c_counter_binary_0/SCLR] [get_bd_pins c_counter_binary_1/SCLR] \
  [get_bd_pins c_counter_binary_2/SCLR]
connect_bd_net [get_bd_pins xlconstant_5/dout] [get_bd_pins fifo_generator_0/rd_en] [get_bd_pins signal_spliter_0/s_axis_valid]
connect_bd_net [get_bd_pins fifo_generator_0/dout] [get_bd_pins signal_spliter_0/s_axis_data]
connect_bd_net [get_bd_pins xlconcat_4/dout] [get_bd_pins util_reduced_logic_2/Op1]
connect_bd_net [get_bd_pins rst_ps7_0_125M/peripheral_reset] [get_bd_pins xlconcat_4/In0]
connect_bd_net [get_bd_pins ch_01/P] [get_bd_pins blk_mem_gen_2/dina]
connect_bd_net [get_bd_pins ch_01/data_out] [get_bd_pins xlconcat_5/In1]
connect_bd_net [get_bd_pins c_counter_binary_2/Q] [get_bd_pins blk_mem_gen_2/addra] [get_bd_pins stop_count_2/value]
connect_bd_net [get_bd_pins xlconcat_5/dout] [get_bd_pins util_reduced_logic_3/Op1]
connect_bd_net [get_bd_pins stop_count_2/en] [get_bd_pins xlconcat_5/In0]
connect_bd_net [get_bd_pins util_reduced_logic_3/Res] \
  [get_bd_pins c_counter_binary_2/CE] [get_bd_pins blk_mem_gen_2/ena] [get_bd_pins blk_mem_gen_2/wea]
connect_bd_net [get_bd_pins xlconstant_4/dout] [get_bd_pins xlconcat_4/In1]

# ---- address map ----
assign_bd_address -offset 0x41200000 -range 4K -target_address_space [get_bd_addr_spaces processing_system7_0/Data] [get_bd_addr_segs axi_gpio_0/S_AXI/Reg]
assign_bd_address -offset 0x43C00000 -range 64K -target_address_space [get_bd_addr_spaces processing_system7_0/Data] [get_bd_addr_segs axi_bram_reader_0/s00_axi/reg0]
assign_bd_address -offset 0x43C10000 -range 64K -target_address_space [get_bd_addr_spaces processing_system7_0/Data] [get_bd_addr_segs axi_bram_reader_1/s00_axi/reg0]
assign_bd_address -offset 0x43C20000 -range 64K -target_address_space [get_bd_addr_spaces processing_system7_0/Data] [get_bd_addr_segs axi_bram_reader_2/s00_axi/reg0]

validate_bd_design
save_bd_design
